# EAGLE design node_rev_a (EAGLE 7.3.0)
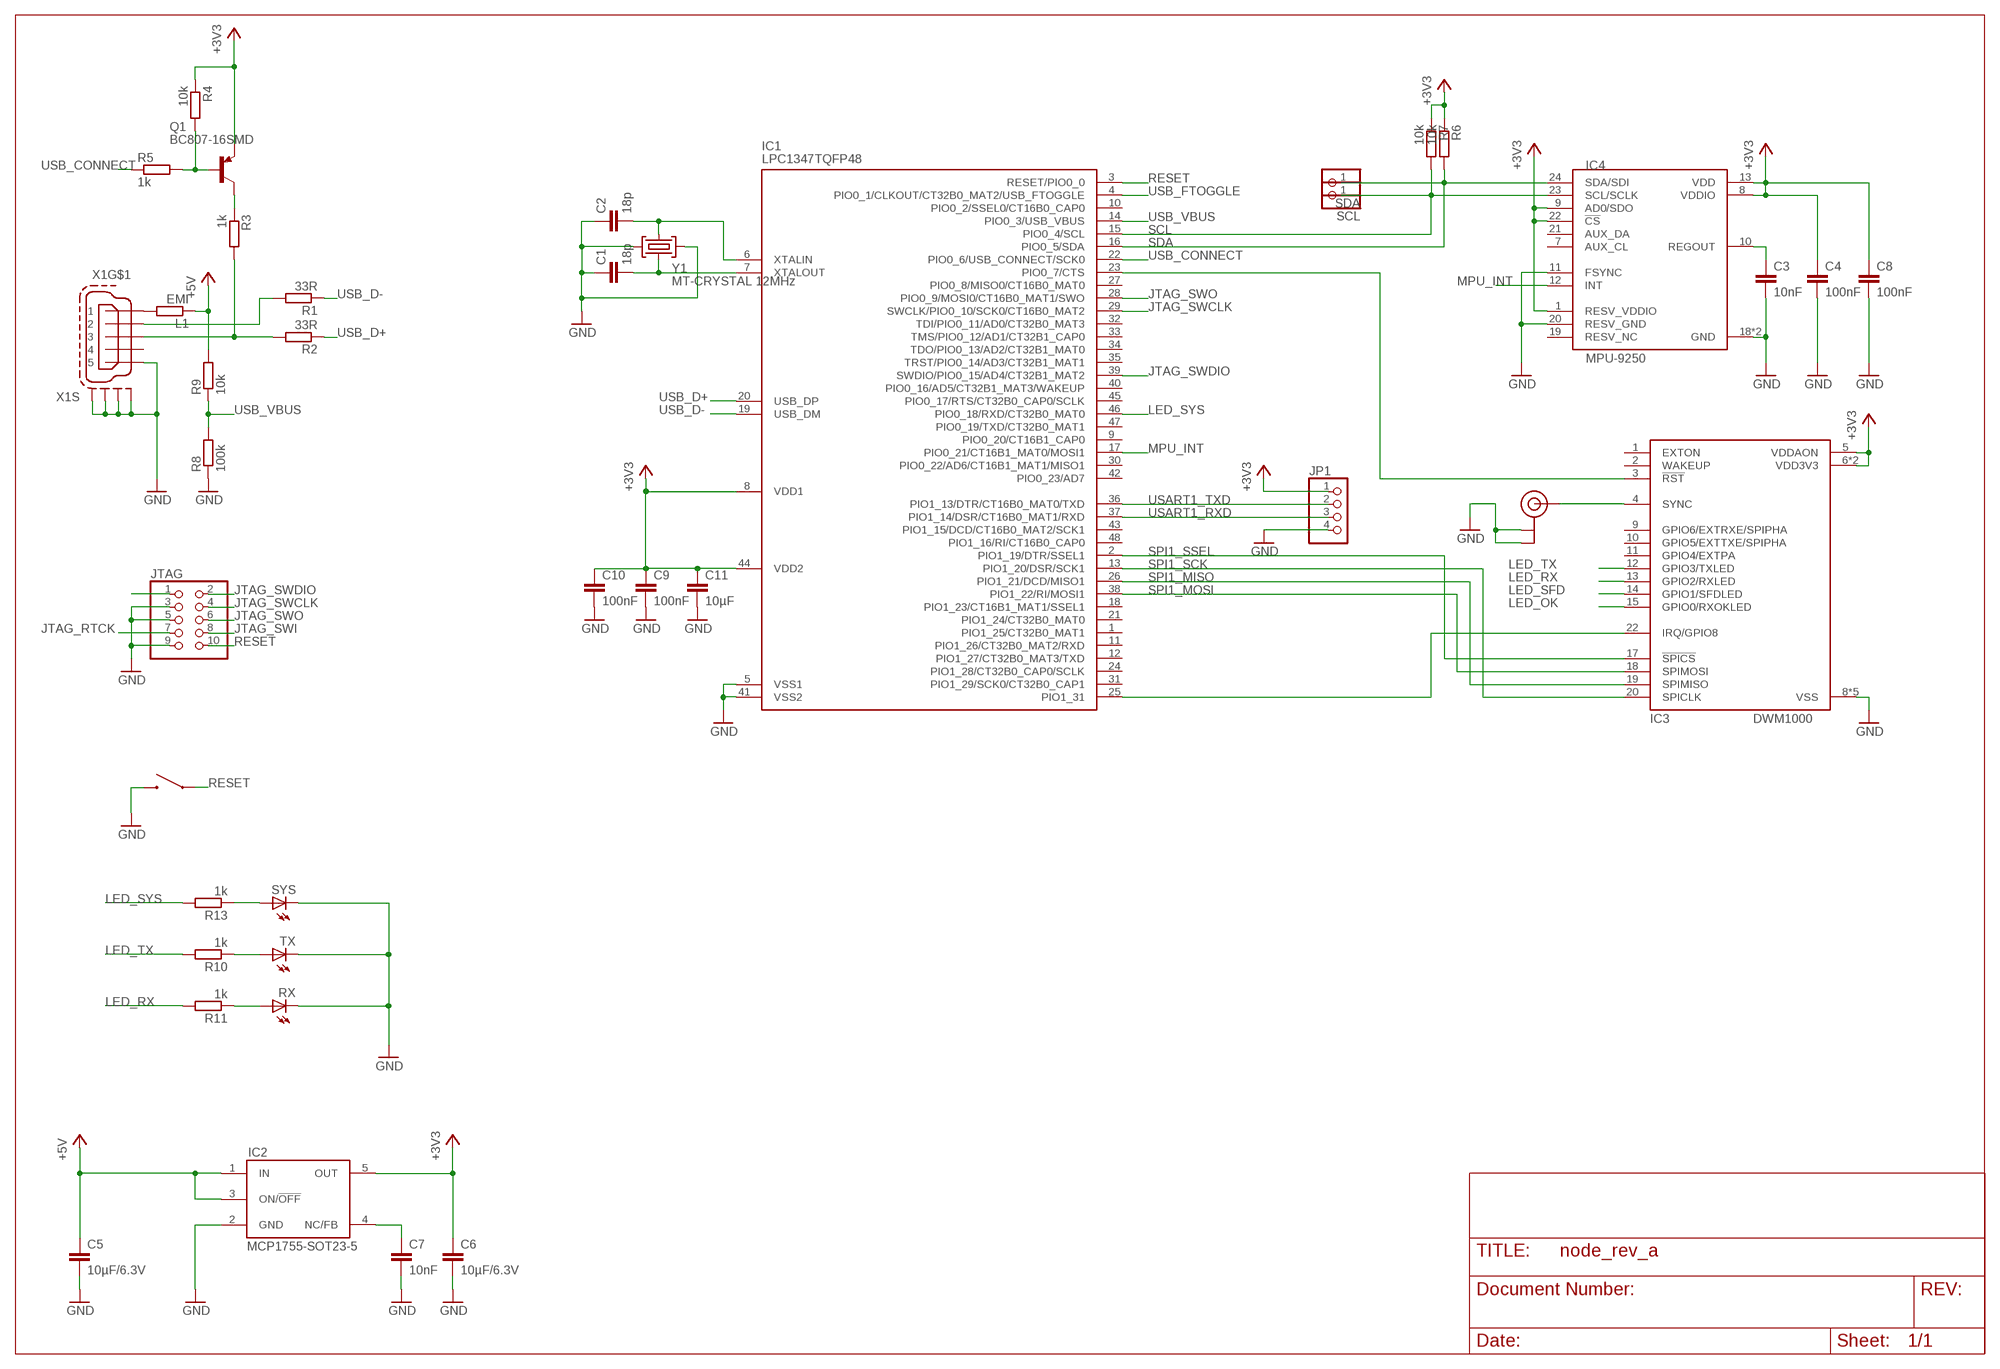
[diagram p0: schematic, sheet 1]

## Parts
C1  18p  C-EUC0603  [C0603]
C2  18p  C-EUC0603  [C0603]
C3  10nF  C-EUC0603  [C0603]
C4  100nF  C-EUC0603  [C0603]
C5  10µF/6.3V  C-EUC0603  [C0603]
C6  10µF/6.3V  C-EUC0603  [C0603]
C7  10nF  C-EUC0603  [C0603]
C8  100nF  C-EUC0603  [C0603]
C9  100nF  C-EUC0603  [C0603]
C10  100nF  C-EUC0603  [C0603]
C11  10µF  C-EUC0603  [C0603]
IC1  LPC1347TQFP48  [LQFP48-7X7]
IC2  MCP1755-SOT23-5  LP2985-SOT23-5  [SOT23-5]
IC3  DWM1000  [DWM1000]
IC4  MPU-9250  [QFN24_3MM]
JP1  HEADER-1X4ROUND  [1X04_ROUND]
JTAG  ARM-JTAG_1.27-SMD  [20021121-10010XXLF]
L1  EMI  R-EU_R0603  [R0603]
Q1  BC807-16SMD  [SOT23-BEC]
R1  33R  R-EU_R0603  [R0603]
R2  33R  R-EU_R0603  [R0603]
R3  1k  R-EU_R0603  [R0603]
R4  10k  R-EU_R0603  [R0603]
R5  1k  R-EU_R0603  [R0603]
R6  10k  R-EU_R0603  [R0603]
R7  10k  R-EU_R0603  [R0603]
R8  100k  R-EU_R0603  [R0603]
R9  10k  R-EU_R0603  [R0603]
R10  1k  R-EU_R0603  [R0603]
R11  1k  R-EU_R0603  [R0603]
R13  1k  R-EU_R0603  [R0603]
RX  LEDCHIP-LED0603  [CHIP-LED0603]
SCL  HEADER-1X12MM  [1X01_2MM]
SDA  HEADER-1X12MM  [1X01_2MM]
SYNC  U.FL  [U.FL]
SYS  LEDCHIP-LED0603  [CHIP-LED0603]
TX  LEDCHIP-LED0603  [CHIP-LED0603]
U$1  TACT-SWITCH-40-40  [40-40]
X1  MINI-USB-SCHIELD-32005-201  [32005-201]
Y1  MT-CRYSTAL 12MHz  MT-CRYSTAL  [MT]

## Nets
+3V3: C4.1 C6.1 C8.1 C9.1 C10.1 C11.1 IC1.8(VDD1) IC1.44(VDD2) IC2.5(OUT) IC3.5(VDDAON) IC3.6(VDD3V3) IC3.7(VDD3V3) IC4.1(RESV_VDDIO) IC4.8(VDDIO) IC4.9(AD0/SDO) IC4.13(VDD) IC4.22(!CS) JP1.1 Q1.E R4.1 R6.1 R7.1
+5V: C5.1 IC2.1(IN) IC2.3(ON/!OFF) L1.1 R9.2
GND: C1.1 C2.1 C3.2 C4.2 C5.2 C6.2 C7.2 C8.2 C9.2 C10.2 C11.2 IC1.5(VSS1) IC1.41(VSS2) IC2.2(GND) IC3.8(VSS) IC3.16(VSS) IC3.21(VSS) IC3.23(VSS) IC3.24(VSS) IC4.11(FSYNC) IC4.18(GND) IC4.20(RESV_GND) IC4.THERM(GND) JP1.4 JTAG.3 JTAG.5 JTAG.9 R8.1 RX.C SYNC.1(GND) SYNC.2(GND) SYS.C TX.C U$1.1 U$1.2 X1.5 X1.M1(S:S1) X1.M2(S:S2) X1.M3(S:S3) X1.M4(S:S4) Y1.2(GND2) Y1.4(GND1)
JTAG_RTCK: JTAG.7
JTAG_SWCLK: IC1.29(SWCLK/PIO0_10/SCK0/CT16B0_MAT2) JTAG.4
JTAG_SWDIO: IC1.39(SWDIO/PIO0_15/AD4/CT32B1_MAT2) JTAG.2
JTAG_SWI: JTAG.8
JTAG_SWO: IC1.28(PIO0_9/MOSI0/CT16B0_MAT1/SWO) JTAG.6
LED_OK: IC3.15(GPIO0/RXOKLED)
LED_RX: IC3.13(GPIO2/RXLED) R11.2
LED_SFD: IC3.14(GPIO1/SFDLED)
LED_SYS: IC1.46(PIO0_18/RXD/CT32B0_MAT0) R13.2
LED_TX: IC3.12(GPIO3/TXLED) R10.2
MPU_INT: IC1.17(PIO0_21/CT16B1_MAT0/MOSI1) IC4.12(INT)
N$1: Q1.B R4.2 R5.2
N$2: Q1.C R3.1
N$3: L1.2 X1.1
N$4: IC1.25(PIO1_31) IC3.22(IRQ/GPIO8)
N$5: R1.2 X1.2
N$6: IC3.4(SYNC) SYNC.3(SIGNAL)
N$8: IC1.23(PIO0_7/CTS) IC3.3(!RST)
N$9: R10.1 TX.A
N$10: R11.1 RX.A
N$11: R13.1 SYS.A
N$12: C3.1 IC4.10(REGOUT)
N$20: C7.1 IC2.4(NC/FB)
N$28: JTAG.1
N$36: R2.2 R3.2 X1.3
RESET: IC1.3(RESET/PIO0_0) JTAG.10 U$1.3 U$1.4
SCL: IC1.15(PIO0_4/SCL) IC4.23(SCL/SCLK) R7.2 SCL.1
SDA: IC1.16(PIO0_5/SDA) IC4.24(SDA/SDI) R6.2 SDA.1
SPI1_MISO: IC1.26(PIO1_21/DCD/MISO1) IC3.19(SPIMISO)
SPI1_MOSI: IC1.38(PIO1_22/RI/MOSI1) IC3.18(SPIMOSI)
SPI1_SCK: IC1.13(PIO1_20/DSR/SCK1) IC3.20(SPICLK)
SPI1_SSEL: IC1.2(PIO1_19/DTR/SSEL1) IC3.17(!SPICS)
USART1_RXD: IC1.37(PIO1_14/DSR/CT16B0_MAT1/RXD) JP1.3
USART1_TXD: IC1.36(PIO1_13/DTR/CT16B0_MAT0/TXD) JP1.2
USB_CONNECT: IC1.22(PIO0_6/USB_CONNECT/SCK0) R5.1
USB_D+: IC1.20(USB_DP) R2.1
USB_D-: IC1.19(USB_DM) R1.1
USB_FTOGGLE: IC1.4(PIO0_1/CLKOUT/CT32B0_MAT2/USB_FTOGGLE)
USB_VBUS: IC1.14(PIO0_3/USB_VBUS) R8.2 R9.1
XTAL1: C2.2 IC1.6(XTALIN) Y1.1(CRYSTAL2)
XTAL2: C1.2 IC1.7(XTALOUT) Y1.3(CRYSTAL1)
Unconnected: IC1.1(PIO1_25/CT32B0_MAT1) IC1.9(PIO0_20/CT16B1_CAP0) IC1.10(PIO0_2/SSEL0/CT16B0_CAP0) IC1.11(PIO1_26/CT32B0_MAT2/RXD) IC1.12(PIO1_27/CT32B0_MAT3/TXD) IC1.18(PIO1_23/CT16B1_MAT1/SSEL1) IC1.21(PIO1_24/CT32B0_MAT0) IC1.24(PIO1_28/CT32B0_CAP0/SCLK) IC1.27(PIO0_8/MISO0/CT16B0_MAT0) IC1.30(PIO0_22/AD6/CT16B1_MAT1/MISO1) IC1.31(PIO1_29/SCK0/CT32B0_CAP1) IC1.32(TDI/PIO0_11/AD0/CT32B0_MAT3) IC1.33(TMS/PIO0_12/AD1/CT32B1_CAP0) IC1.34(TDO/PIO0_13/AD2/CT32B1_MAT0) IC1.35(TRST/PIO0_14/AD3/CT32B1_MAT1) IC1.40(PIO0_16/AD5/CT32B1_MAT3/WAKEUP) IC1.42(PIO0_23/AD7) IC1.43(PIO1_15/DCD/CT16B0_MAT2/SCK1) IC1.45(PIO0_17/RTS/CT32B0_CAP0/SCLK) IC1.47(PIO0_19/TXD/CT32B0_MAT1) IC1.48(PIO1_16/RI/CT16B0_CAP0) IC3.1(EXTON) IC3.2(WAKEUP) IC3.9(GPIO6/EXTRXE/SPIPHA) IC3.10(GPIO5/EXTTXE/SPIPHA) IC3.11(GPIO4/EXTPA) IC4.7(AUX_CL) IC4.19(RESV_NC) IC4.21(AUX_DA) X1.4

## Library data of the parts
C1-C11 = rcl:C-EU: CAPACITOR, European symbol
IC1 = lpc1xxx:LPC1347
IC2 = vreg:LP2985
IC3 = decawave:DWM1000
IC4 = invensense:MPU-9250
JP1 = microbuilder:HEADER-1X4: PIN HEADER
JTAG = nxp:ARM-JTAG: PIN HEADER
L1 R1-R11 R13 = rcl:R-EU_: RESISTOR, European symbol
Q1 = transistor-pnp:BC807*: PNP Transistror
RX SYS TX = led:LED: LED OSRAM: - CHIPLED LG R971, LG N971, LY N971, LG Q971, LY Q971, LO R971, LY R971 LH N974, LH R974 LS Q976, LO Q976, LY Q976 LO Q996 - Hyper CHIPLED LW Q18S LB Q993, LB Q99A, LB R99A - SideLED LS A670, LO A670, LY A670, LG A670, LP A670 LB A673, LV A673, LT A673, LW A673 LH A674 LY A675 LS A676, LA A676, LO A676, LY A676, LW A676 LS A679, LY A679, LG A679 - Hyper Micro SIDELED® LS Y876, LA Y876, LO Y876, LY Y876 LT Y87S - SmartLED LW L88C, LW L88S LB L89C, LB L89S, LG L890 LS L89K, LO L89K, LY L89K LS L896, LA L896, LO L896, LY L896 - TOPLED LS T670, LO T670, LY T670, LG T670, LP T670 LSG T670, LSP T670, LSY T670, LOP T670, LYG T670 LG T671, LOG T671, LSG T671 LB T673, LV T673, LT T673, LW T673 LH T674 LS T676, LA T676, LO T676, LY T676, LB T676, LH T676, LSB T676, LW T676 LB T67C, LV T67C, LT T67C, LS T67K, LO T67K, LY T67K, LW E67C LS E67B, LA E67B, LO E67B, LY E67B, LB E67C, LV E67C, LT E67C LW T67C LS T679, LY T679, LG T679 LS T770, LO T770, LY T770, LG T770, LP T770 LB T773, LV T773, LT T773, LW T773 LH T774 LS E675, LA E675, LY E675, LS T675 LS T776, LA T776, LO T776, LY T776, LB T776 LHGB T686 LT T68C, LB T68C - Hyper Mini TOPLED® LB M676 - Mini TOPLED Santana® LG M470 LS M47K, LO M47K, LY M47K Source: http://www.osram.convergy.de LUXEON: - LUMILED® LXK2-PW12-R00, LXK2-PW12-S00, LXK2-PW14-U00, LXK2-PW14-V00 LXK2-PM12-R00, LXK2-PM12-S00, LXK2-PM14-U00 LXK2-PE12-Q00, LXK2-PE12-R00, LXK2-PE12-S00, LXK2-PE14-T00, LXK2-PE14-U00 LXK2-PB12-K00, LXK2-PB12-L00, LXK2-PB12-M00, LXK2-PB14-N00, LXK2-PB14-P00, LXK2-PB14-Q00 LXK2-PR12-L00, LXK2-PR12-M00, LXK2-PR14-Q00, LXK2-PR14-R00 LXK2-PD12-Q00, LXK2-PD12-R00, LXK2-PD12-S00 LXK2-PH12-R00, LXK2-PH12-S00 LXK2-PL12-P00, LXK2-PL12-Q00, LXK2-PL12-R00 Source: www.luxeon.com KINGBRIGHT: KA-3528ASYC Source: www.kingbright.com
SCL SDA = microbuilder:HEADER-1X1: PIN HEADER
SYNC = microbuilder:U.FL: U.FL Antenna Connector
U$1 = tactile-switch:TACT-SWITCH-40-40
X1 = con-cypressindustries:MINI-USB-SCHIELD-: MINI USB-B Conector Source: www.cypressindustries.com; OC_FARNELL: unknown; OC_NEWARK: unknown
Y1 = euroquartz:MT-CRYSTAL: Ultra-small package 3.2mm x 2.5mm x 0.6mm

## Board
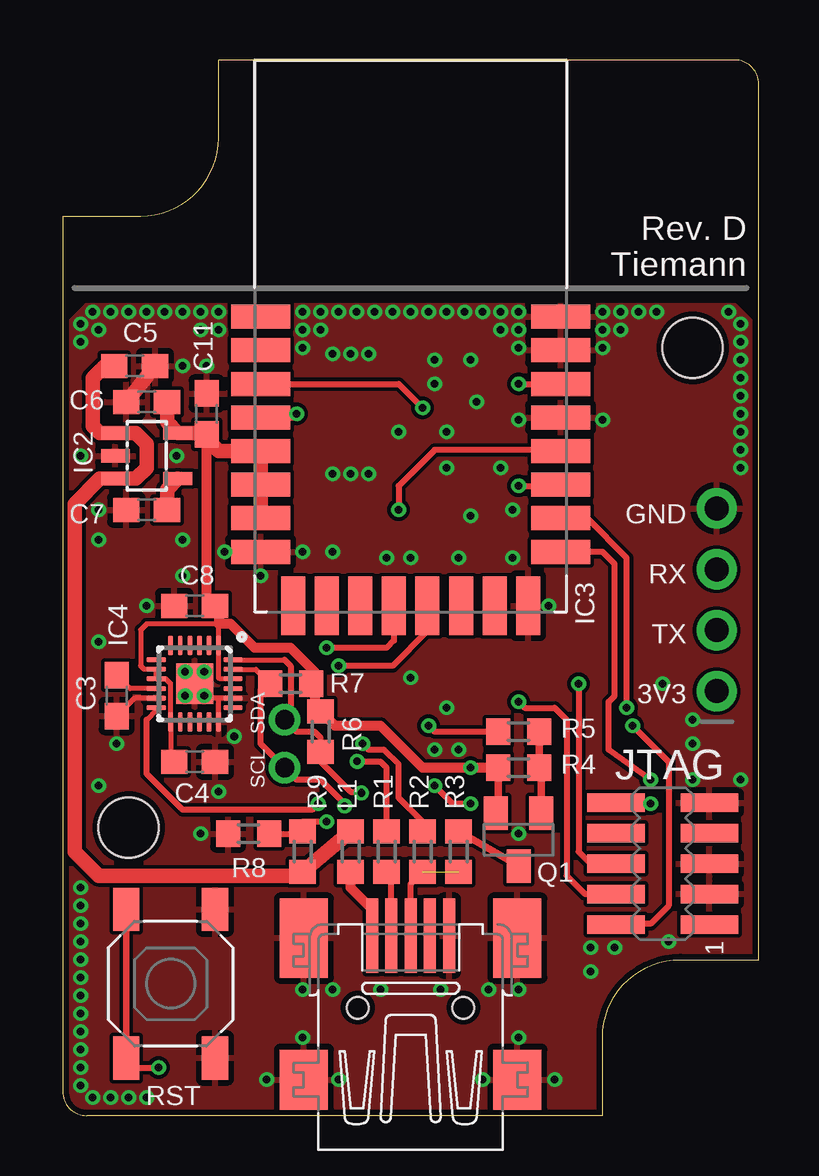
[diagram p1: board, top side]
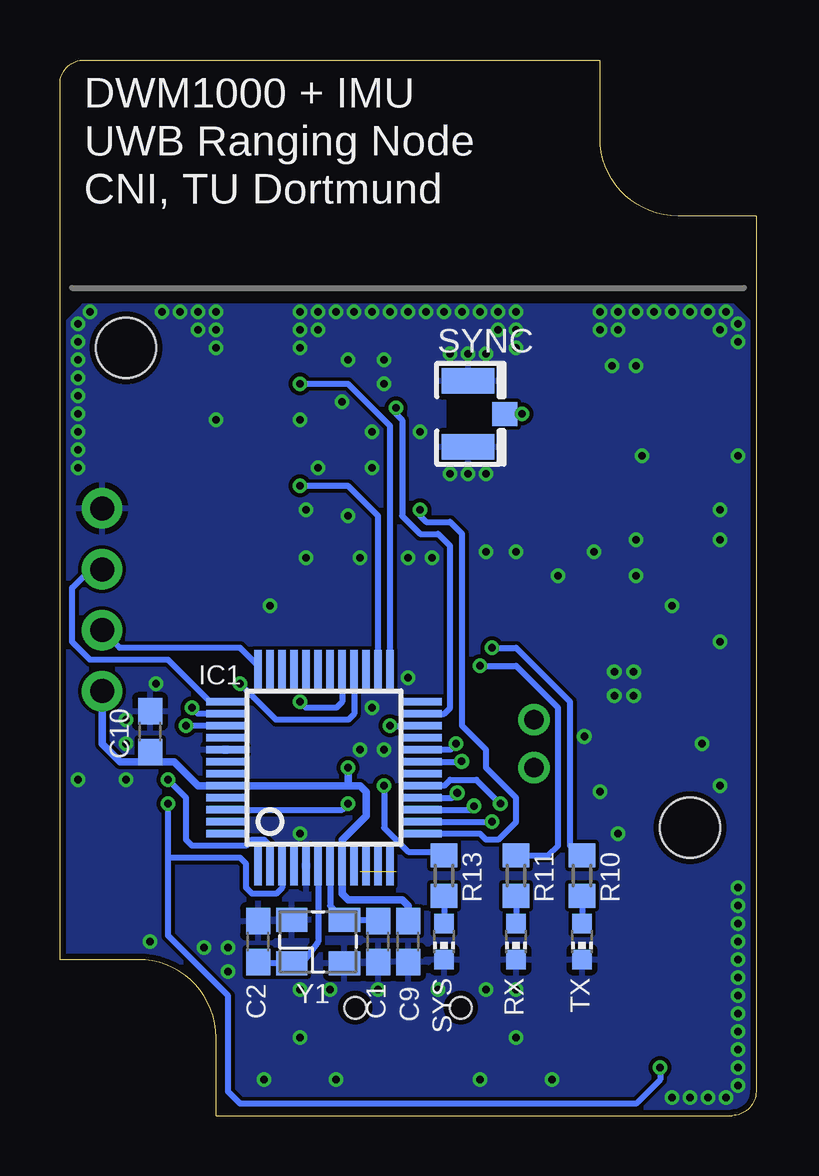
[diagram p2: board, bottom side, seen from below]

Size 29 x 44 mm. Coordinates in mm from the lower left corner, seen from the top.
Outline: 22.5,0 1,0 arc-90 0,1 0,37.5 3.25,37.5 arc90 6.5,40.75 6.5,44 28,44 arc-90 29,43 29,6.5 25.75,6.5 arc90 22.5,3.25 22.5,0
Copper layers (1*16): Top 0.035mm / dielectric 1.5mm / Bottom 0.035mm
Design rules "default": minimum track width 6mil, minimum drill 12mil, track to track 6mil, track to pad 6mil, pad to pad 6mil, via to via 6mil, smd to smd 0mil, copper to edge 10mil, drill to drill 10mil, minimum pad ring 10mil, minimum via ring 6mil, stop-mask expansion 2mil, vias tented up to drill 100mil, thermal gap 10mil
Holes 2.5 mm at 26.25,32 2.75,12

### Footprints (pad centres in the part's own frame; a part is rotated, then mirrored left to right if it is on the bottom)
C0603 = smd 1.1 x 1: 1 -0.85,0; 2 0.85,0
LQFP48-7X7 = smd 0.3 x 1.6: 1 -2.75,-4.1; 2 -2.25,-4.1; 3 -1.75,-4.1; 4 -1.25,-4.1; 5 -0.75,-4.1; 6 -0.25,-4.1; 7 0.25,-4.1; 8 0.75,-4.1; 9 1.25,-4.1; 10 1.75,-4.1; 11 2.25,-4.1; 12 2.75,-4.1; 25 2.75,4.1; 26 2.25,4.1; 27 1.75,4.1; 28 1.25,4.1; 29 0.75,4.1; 30 0.25,4.1; 31 -0.25,4.1; 32 -0.75,4.1; 33 -1.25,4.1; 34 -1.75,4.1; 35 -2.25,4.1; 36 -2.75,4.1 | smd 1.6 x 0.3: 13 4.1,-2.75; 14 4.1,-2.25; 15 4.1,-1.75; 16 4.1,-1.25; 17 4.1,-0.75; 18 4.1,-0.25; 19 4.1,0.25; 20 4.1,0.75; 21 4.1,1.25; 22 4.1,1.75; 23 4.1,2.25; 24 4.1,2.75; 37 -4.1,2.75; 38 -4.1,2.25; 39 -4.1,1.75; 40 -4.1,1.25; 41 -4.1,0.75; 42 -4.1,0.25; 43 -4.1,-0.25; 44 -4.1,-0.75; 45 -4.1,-1.25; 46 -4.1,-1.75; 47 -4.1,-2.25; 48 -4.1,-2.75
SOT23-5 = smd 0.55 x 1.2: 1 -0.95,-1.3; 2 0,-1.3; 3 0.95,-1.3; 4 0.95,1.3; 5 -0.95,1.3
DWM1000 = smd 2.45 x 1: 1 -6.25,0.8; 2 -6.25,-0.6; 3 -6.25,-2; 4 -6.25,-3.4; 5 -6.25,-4.8; 6 -6.25,-6.2; 7 -6.25,-7.6; 8 -6.25,-9; 17 6.25,-9; 18 6.25,-7.6; 19 6.25,-6.2; 20 6.25,-4.8; 21 6.25,-3.4; 22 6.25,-2; 23 6.25,-0.6; 24 6.25,0.8 | smd 1 x 2.45: 9 -4.9,-11.25; 10 -3.5,-11.25; 11 -2.1,-11.25; 12 -0.7,-11.25; 13 0.7,-11.25; 14 2.1,-11.25; 15 3.5,-11.25; 16 4.9,-11.25
QFN24_3MM = smd 0.8 x 0.2: 1 -1.6,1; 2 -1.6,0.6; 3 -1.6,0.2; 4 -1.6,-0.2; 5 -1.6,-0.6; 6 -1.6,-1; 13 1.6,-1; 14 1.6,-0.6; 15 1.6,-0.2; 16 1.6,0.2; 17 1.6,0.6; 18 1.6,1 | smd 0.2 x 0.8: 7 -1,-1.6; 8 -0.6,-1.6; 9 -0.2,-1.6; 10 0.2,-1.6; 11 0.6,-1.6; 12 1,-1.6; 19 1,1.6; 20 0.6,1.6; 21 0.2,1.6; 22 -0.2,1.6; 23 -0.6,1.6; 24 -1,1.6 | smd 1.7 x 1.54: THERM 0,0
1X04_ROUND = drill 1 pad 1.676: 1 -3.81,0; 2 -1.27,0; 3 1.27,0; 4 3.81,0
20021121-10010XXLF = smd 0.76 x 2.4: 1 -2.54,-1.95; 2 -2.54,1.95; 3 -1.27,-1.95; 4 -1.27,1.95; 5 0,-1.95; 6 0,1.95; 7 1.27,-1.95; 8 1.27,1.95; 9 2.54,-1.95; 10 2.54,1.95
R0603 = smd 1 x 1.1: 1 -0.85,0; 2 0.85,0
SOT23-BEC = smd 1 x 1.4: B -0.95,-1.1; C 0,1.1; E 0.95,-1.1
CHIP-LED0603 = smd 0.8 x 0.8: A 0,-0.75; C 0,0.75
1X01_2MM = drill 0.8 pad 1.27: 1 0,0
U.FL = smd 2.2 x 1.05: 1 0,1.375; 2 0,-1.375 | smd 1.05 x 1: 3 1.525,0
40-40 = smd 1.8 x 1.1: 1 -3.1,1.85; 2 3.1,1.85; 3 -3.1,-1.85; 4 3.1,-1.85
32005-201 = smd 3.1 x 0.5: 1 3,1.6; 2 3,0.8; 3 3,0; 4 3,-0.8; 5 3,-1.6 | smd 2.5 x 2: M1 -3,-4.45; M2 -3,4.45 | smd 3.3 x 2: M3 2.9,4.45; M4 2.9,-4.45 | hole 0.9: 0,2.2; 0,-2.2
MT = smd 1.3 x 1: 1 -1.1,-0.9; 2 1.1,-0.9; 3 1.1,0.9; 4 -1.1,0.9

### Placement (x,y rotation side)
C1  15.75,7.25 90 bottom
C2  20.75,7.25 270 bottom
C3  2.25,17.5 270 top
C4  5.5,14.75 0 top
C5  3,31.25 0 top
C6  3.5,29.75 180 top
C7  3.5,25.25 180 top
C8  5.5,21.25 180 top
C9  14.5,7.25 270 bottom
C10  25.25,16 90 bottom
C11  6,29.25 90 top
IC1  18,14.5 0 bottom
IC2  3.5,27.5 270 top
IC3  14.5,32.5 0 top
IC4  5.5,18 270 top
JP1  27.25,21.5 90 top
JTAG  25,10.5 90 top
L1  12,11 270 top
Q1  19,11.5 180 top
R1  13.5,11 270 top
R2  15,11 270 top
R3  16.5,11 270 top
R4  19,14.5 0 top
R5  19,16 0 top
R6  10.75,16 270 top
R7  9.5,18 180 top
R8  7.75,11.75 0 top
R9  10,11 270 top
R10  7.25,10 90 bottom
R11  10,10 90 bottom
R13  13,10 90 bottom
RX  10,7.25 180 bottom
SCL  9.25,14.5 0 top
SDA  9.25,16.5 0 top
SYNC  12,29.25 0 bottom
SYS  13,7.25 180 bottom
TX  7.25,7.25 180 bottom
U$1  4.5,5.5 270 top
X1  14.5,4.5 90 top
Y1  18.25,7.25 0 bottom

### Tracks (layer width: path | path; a pad name or v marks a point on that pad's centre or on a via)
+3V3  (via drill 0.32)
  Top 0.2: IC4.22 6.55,18.2 6.5,18.25 IC4.1 6.5,20.5 3.5,20.5 3.25,20.25 3.25,18.75 3.4,18.6 IC4.8 IC4.9 4.3,18.2 4.5,18 IC4.13 4.5,14.9 C4.1
  Top 0.254: 6.5,21.1 C8.1
  Top 0.305: R4.1 18.15,12.7 Q1.E 17.9,12.6
  Top 0.406: 6.25,21.25 6.35,21.15 C8.1 6.25,21.25 | 6.25,21.25 6,21.5 C11.1 | R4.1 v17,14.5 15,14.5 13.25,16.25 11.35,16.25 R6.1 10.5,17.1 10.5,18.5 | 10.5,18.5 9.5,19.5 8,19.5 7,20.5 6.5,20.5 6.5,21.1 | R7.1 10.35,18.35 10.5,18.5
  Top 0.61: IC3.7 IC3.6 IC3.5 6.5,27.7 6.3,27.9 C11.1 5.65,28.45 IC2.5 4.35,28.9 C6.1
  Bottom 0.305: 17,13.75 16.5,13.75 16.25,13.5 16.25,12.5 17.25,11.5 IC1.8 17.25,9.25 17,9 14.75,9 14.5,8.75 C9.1 | 17,13.75 IC1.44 23.25,13.75 24.25,14.75 25.1,14.75 | v17,14.5 17,13.75 | 25.1,14.75 26.5,14.75 27.25,15.5 JP1.1 | 25.1,14.75 C10.1
+5V
  Top 0.406: IC2.3 3.05,26.55
  Top 0.61: 11.85,12 L1.1 R9.2 9.85,10 1.5,10 0.5,11 0.5,25.5 1.55,26.55 3.05,26.55 3.5,27 3.5,28 3.05,28.45 IC2.1 1.55,28.45 1.25,28.75 1.25,30.75 1.75,31.25 C5.1
GND  (via drill 0.32)
  Top 0.2: IC4.11 3,17.4 C3.2 | IC4.20 6.5,17.4 | 6.5,17.4 6.1,17.4 | IC4.18 6.5,17.4
  Top 0.254: 6.1,17.4 IC4.THERM
  Top 0.61: C6.2 C5.2
  other vias: 5.75,32.75 10.75,32.75 22.5,32.75 11.5,33.5 10.75,33.5 10,32.75 10,33.5 19,33.5 22.5,33.5 18.25,33.5 19,32.75 17.5,33.5 16.75,33.5 18.25,32.75 15.25,33.5 10,32 16,33.5 19,32 4.25,33.5 0.75,27.5 2.75,33.5 2,33.5 5.75,33.5 5,33.5 6.5,33.5 3.5,33.5 5,31.25 13.75,33.5 12.25,33.5 6.5,32.75 23.25,33.5 24,33.5 24.75,33.5 23.25,32.75 13,33.5 0.75,32.25 4.75,27.5 1.25,33.5 14.5,33.5 1.5,25.25 0.75,33 22.5,32 1.5,32.75 0.75,1.25 1.25,0.75 0.75,2 0.75,2.75 0.75,3.5 0.75,4.25 0.75,5 0.75,5.75 0.75,6.5 0.75,7.25 0.75,8 0.75,8.75 0.75,9.5 2.25,15.5 7.15,15.8 5.75,11.75 3.5,21.25 8.25,22.5 10,23.5 6.75,23.5 20.25,21.25 27.75,33.5 28.25,33 28.25,32.25 28.25,31.5 28.25,30.75 22.5,29 15.75,5.25 17.75,5.25 19,5.25 13.25,5.25 11.25,5.25 10,5.25 2,0.75 2.75,0.75 3.5,0.75 10,3.25 19,3.25 8.5,1.5 20.5,1.5 17.5,1.5 11.5,1.5 19,29 18.75,23.25 16.5,23.25 18.75,25.25 17,25 18.25,27 16,27 16,28.5 17.25,29.75 11.25,23.5 11.25,26.75 12.75,31.75 14,28.5 15.5,30.5 14.5,23.25 13.5,23.25 12.75,26.75 12,26.75 11.25,31.75 12,31.75 15.5,31.5 17,31.5 6,31.25 5,24 5,22.5 1.5,24 1.5,19.75 1.5,13.75 6.5,13.5 16,17 14.5,18.25 26.25,15.5 25,18 26.25,16.5 28.25,14 25.25,7.25 26.25,14 28.25,30 28.25,29.25 28.25,28.5 28.25,27.75 28.25,27 22,7 23,7 22,6 16.5,15.25 15.5,15.25 19,11.75 5.1,17.5 5.9,17.5 5.1,18.5 5.9,18.5
  pour Bottom: 29.5,32.25 28,33.75 1,33.75 0,32.75 0,1 1,0 22.5,0 22.5,4 25,6.5 29.5,6.5
  pour Top: 1,33.75 -0.5,32.25 -0.5,1.5 1,0 22.5,0 22.5,3.5 25.5,6.5 29,6.5 29,32.75 28,33.75
JTAG_SWCLK  (via drill 0.32)
  Top 0.254: v19,17.25 19.25,17 20.5,17 21,16.5 21,10 21.75,9.25 23.03,9.25 JTAG.4
  Bottom 0.254: IC1.29 17.25,17.25 17.5,17 18.75,17 v19,17.25
JTAG_SWDIO  (via drill 0.32)
  Top 0.254: v23.75,16.25 25.25,14.75 25.25,8.75 24.5,8 23.09,8 JTAG.2
  Bottom 0.254: IC1.39 v23.75,16.25
JTAG_SWO  (via drill 0.32)
  Top 0.254: v21.5,18 21.5,11 22,10.5 JTAG.6
  Bottom 0.254: IC1.28 16.75,16.75 17,16.5 20,16.5 v21.5,18
LED_RX  (via drill 0.32)
  Top 0.254: IC3.13 15.2,20.2 13.75,18.75 v11.5,18.75
  Bottom 0.254: v11.5,18.75 10,18.75 8.25,17 8.25,11.25 8.65,10.85 R11.2
LED_SYS  (via drill 0.32)
  Top 0.254: v17,13 16.25,13 v15.5,13.75
  Bottom 0.254: IC1.46 17.25,12.75 v17,13 | v15.5,13.75 15.5,12 14.5,11 13.15,11 R13.2
LED_TX  (via drill 0.32)
  Top 0.254: IC3.12 13.8,19.8 13.5,19.5 v11,19.5
  Bottom 0.254: v11,19.5 10,19.5 7.75,17.25 7.75,11.25 7.35,10.85 R10.2
MPU_INT  (via drill 0.32)
  Top 0.2: IC4.12 3.9,16.9 3.5,16.5
  Top 0.254: v10.65,13 10.4,12.75 5,12.75 3.5,14.25 3.5,16.5
  Bottom 0.254: IC1.17 13,13.75 12.75,14 11.65,14 v10.65,13
N$1
  Top 0.305: Q1.B 19.95,14.4 R4.2 R5.2
N$2
  Top 0.305: Q1.C R3.1
N$3
  Top 0.406: X1.1 12.9,8.6 12,9.5 L1.2
N$4  (via drill 0.32)
  Top 0.254: v19,30.5 IC3.22
  Bottom 0.254: IC1.25 15.25,28.75 17,30.5 v19,30.5
N$5
  Top 0.254: X1.2 13.7,9.95 R1.2
N$6  (via drill 0.32)
  Top 0.254: IC3.4 9.6,29.1 v9.75,29.25
  Bottom 0.254: v9.75,29.25 SYNC.3
N$8  (via drill 0.32)
  Top 0.254: IC3.3 14,30.5 v15,29.5
  Bottom 0.254: IC1.23 13,16.75 12.75,17 12.75,23.75 13.25,24.25 14,24.25 14.75,25 14.75,29 15,29.25 v15,29.5
N$9
  Bottom 0.254: R10.1 TX.A
N$10
  Bottom 0.254: R11.1 RX.A
N$11
  Bottom 0.254: R13.1 SYS.A
N$12
  Top 0.2: IC4.10 2.8,17.8 C3.1
N$20
  Top 0.61: C7.1 4.35,26.1 IC2.4
N$36  (1 unrouted)
  Top 0.254: X1.3 14.5,9.65 R2.2
RESET  (via drill 0.32)
  Top 0.254: v24.5,13 23.01,13 | 23,13 23.01,13 | 23.01,13 JTAG.10 | U$1.4 U$1.3 2.65,2.35 3,2 v4,2
  Bottom 0.254: IC1.3 19.75,9.5 20,9.25 21,9.25 21.25,9.5 21.25,10.5 21.5,10.75 24.5,10.75 | 24.5,10.75 v24.5,13 | v4,2 4,1.5 5,0.5 21.5,0.5 22,1 22,5 24.5,7.5 24.5,10.75
SCL  (via drill 0.32)
  Top 0.2: IC4.23 8.05,18.6 R7.2
  Top 0.254: 8.5,18 R7.2 9,17.65 8.5,18 | 8.5,18 8.25,17.75 8.25,15.5 SCL.1 9.75,14 10.75,14 11.75,13 v11.75,12.9 | 8.75,17.75 8.5,18
  Bottom 0.254: v11.75,12.9 11.9,12.75 IC1.15
SDA  (via drill 0.32)
  Top 0.2: IC4.24 9.25,19
  Top 0.254: 9.25,19 9.5,18.75 9.5,16.75 SDA.1 9.75,16 10.5,16 10.75,15.75 R6.2 10.75,14.75 12,13.5 12.4,13.5 v12.45,13.45
  Bottom 0.254: IC1.16 12.65,13.25 v12.45,13.45
SPI1_MISO  (via drill 0.32)
  Top 0.254: v19,26.25 20.7,26.25 IC3.19
  Bottom 0.254: IC1.26 15.75,25 17,26.25 v19,26.25
SPI1_MOSI  (via drill 0.32)
  Top 0.254: v23.5,17 23.5,23.25 21.85,24.9 IC3.18
  Bottom 0.254: IC1.38 23.25,16.75 v23.5,17
SPI1_SCK  (via drill 0.32)
  Top 0.254: IC3.20 20.7,27.75 15.5,27.75 14,26.25 v14,25.25
  Bottom 0.254: v14,25.25 14,25 13.75,24.75 12.75,24.75 12.25,24.25 12.25,16.25 11.25,15.25 11.25,14.5 10,13.25 10,12.25 10.75,11.5 11.25,11.5 11.5,11.75 IC1.13
SPI1_SSEL  (via drill 0.32)
  Top 0.254: v24.5,14 22.75,15.25 22.75,17.25 23,17.5 23,23 22.5,23.5 IC3.17
  Bottom 0.254: IC1.2 20.25,11.25 20.5,11.5 21,11.5 21.25,11.25 23.5,11.25 23.75,11.5 23.75,13.25 v24.5,14
USART1_RXD
  Bottom 0.254: IC1.37 22.75,17.25 24.5,19 27.75,19 28.5,19.75 28.5,22 27.75,22.75 27.27,22.75 JP1.3
USART1_TXD
  Bottom 0.254: IC1.36 20.75,18.75 21.5,19.5 26.52,19.5 JP1.2
USB_CONNECT  (via drill 0.32)
  Top 0.254: R5.1 15.5,16 v15.25,16.25
  Bottom 0.254: v15.25,16.25 IC1.22
USB_D+  (via drill 0.32)
  Top 0.254: R2.1 15,12.25 14,13.25 14,14.65 13.4,15.25 12.75,15.25 v12.5,15.5
  Bottom 0.254: v12.5,15.5 12.75,15.25 IC1.20
USB_D-  (via drill 0.32)
  Top 0.254: R1.1 13.5,14.5 13.25,14.75 12.29,14.75 v12.27,14.77
  Bottom 0.254: IC1.19 12.29,14.75 v12.27,14.77
USB_VBUS  (via drill 0.32)
  Top 0.254: v11,12.25 10,12.25 R9.1 | R9.1 10,11.75 | R8.2 9.9,11.75 R9.1
  Bottom 0.254: IC1.14 v11,12.25
XTAL1
  Bottom 0.254: C2.2 20.45,6.35 Y1.1 18.9,6.35 18.25,7.25 IC1.6
XTAL2
  Bottom 0.254: C1.2 15.55,8.15 Y1.3 17.75,8.75 IC1.7

### Text on the board
tPlace: Rev. D | Tiemann | GND | RX | TX | 3V3 | RST
bPlace: DWM1000 + IMU | UWB Ranging Node | CNI, TU Dortmund